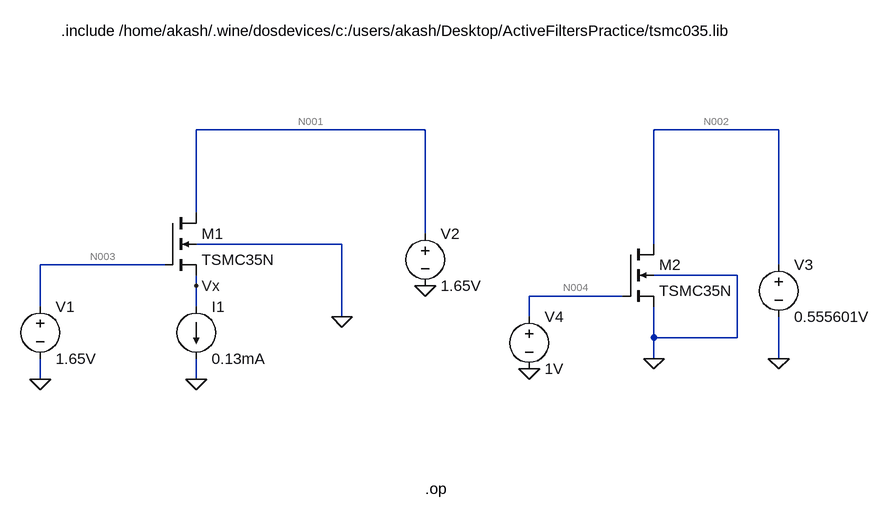
[diagram p0: schematic New_Transconductor_NMOS_Biasing.asc]
New_Transconductor_NMOS_Biasing.asc, the LTspice schematic file:
Version 4
SHEET 1 1112 744
WIRE 416 176 64 176
WIRE 960 176 768 176
WIRE 64 304 64 176
WIRE 416 336 416 176
WIRE 288 352 64 352
WIRE 768 352 768 176
WIRE 16 384 -176 384
WIRE 960 384 960 176
WIRE 896 400 768 400
WIRE 64 416 64 400
WIRE 720 432 576 432
WIRE -176 448 -176 384
WIRE 64 448 64 416
WIRE 288 464 288 352
WIRE 576 464 576 432
WIRE 768 496 768 448
WIRE 896 496 896 400
WIRE 896 496 768 496
WIRE 768 528 768 496
WIRE 960 528 960 464
WIRE -176 560 -176 528
WIRE 64 560 64 528
FLAG 288 464 0
FLAG -176 560 0
FLAG 416 416 0
FLAG 64 560 0
FLAG 960 528 0
FLAG 576 544 0
FLAG 768 528 0
FLAG 64 416 Vx
SYMBOL nmos4 16 304 R0
SYMATTR InstName M1
SYMATTR Value TSMC35N
SYMATTR Value2 l=0.5u w=1.77u m=8
SYMBOL voltage -176 432 R0
WINDOW 123 0 0 Left 0
WINDOW 39 0 0 Left 0
SYMATTR InstName V1
SYMATTR Value 1.65V
SYMBOL voltage 416 320 R0
WINDOW 123 0 0 Left 0
WINDOW 39 0 0 Left 0
SYMATTR InstName V2
SYMATTR Value 1.65V
SYMBOL current 64 448 R0
WINDOW 123 0 0 Left 0
WINDOW 39 0 0 Left 0
SYMATTR InstName I1
SYMATTR Value 0.13mA
SYMBOL voltage 960 368 R0
SYMATTR InstName V3
SYMATTR Value 0.555601V
SYMBOL nmos4 720 352 R0
SYMATTR InstName M2
SYMATTR Value TSMC35N
SYMATTR Value2 l=0.5u w=1.33u m=16
SYMBOL voltage 576 448 R0
WINDOW 123 0 0 Left 0
WINDOW 39 0 0 Left 0
SYMATTR InstName V4
SYMATTR Value 1V
TEXT -144 24 Left 2 !.include /home/akash/.wine/dosdevices/c:/users/akash/Desktop/ActiveFiltersPractice/tsmc035.lib
TEXT 416 728 Left 2 !.op

The netlist it stands for:
* New_Transconductor_NMOS_Biasing.asc
M1 N001 N003 Vx 0 TSMC35N l=0.5u w=1.77u m=8
V1 N003 0 1.65V
V2 N001 0 1.65V
I1 Vx 0 0.13mA
V3 N002 0 0.555601V
M2 N002 N004 0 0 TSMC35N l=0.5u w=1.33u m=16
V4 N004 0 1V
.model NMOS NMOS
.model PMOS PMOS
.lib standard.mos
.include /home/akash/.wine/dosdevices/c:/users/akash/Desktop/ActiveFiltersPractice/tsmc035.lib
.op
.backanno
.end

* Results of the author's LTspice run, read from the files saved beside the schematic
* Operating Point:
*   V(n001) = 1.65 V
*   V(n003) = 1.65 V
*   V(vx) = 555.6 mV
*   V(n002) = 555.6 mV
*   V(n004) = 1 V
*   Id(M2) = 260.3 µA
*   Ig(M2) = 0 A
*   Ib(M2) = -9.05 pA
*   Is(M2) = -260.3 µA
*   Id(M1) = 130 µA
*   Ig(M1) = 0 A
*   Ib(M1) = -17.8 pA
*   Is(M1) = -130 µA
*   I(I1) = 130 µA
*   I(V4) = 0 A
*   I(V3) = -260.3 µA
*   I(V2) = -130 µA
*   I(V1) = 0 A
* From the log:
*   Semiconductor Device Operating Points:
*                           --- BSIM3 MOSFETS ---
*   Name:        m2          m1
*   Model:     tsmc35n     tsmc35n
*   Id:        2.60e-04    1.30e-04
*   Vgs:       1.00e+00    1.09e+00
*   Vds:       5.56e-01    1.09e+00
*   Vbs:       0.00e+00   -5.56e-01
*   Vth:       6.65e-01    8.37e-01
*   Vdsat:     2.38e-01    2.07e-01
*   Gm:        1.55e-03    1.00e-03
*   Gds:       5.96e-05    1.60e-05
*   Gmb        3.79e-04    2.14e-04
*   Cbd:       0.00e+00    0.00e+00
*   Cbs:       0.00e+00    0.00e+00
*   Cgsov:     4.65e-15    3.31e-15
*   Cgdov:     4.65e-15    3.31e-15
*   Cgbov:     7.25e-16    3.63e-16
*   dQgdVgb:   3.73e-14    2.59e-14
*   dQgdVdb:  -4.53e-15   -3.19e-15
*   dQgdVsb:  -2.95e-14   -2.08e-14
*   dQddVgb:  -1.57e-14   -1.11e-14
*   dQddVdb:   4.59e-15    3.24e-15
*   dQddVsb:   1.43e-14    9.70e-15
*   dQbdVgb:  -5.90e-15   -3.71e-15
*   dQbdVdb:  -9.84e-18    1.21e-17
*   dQbdVsb:  -3.87e-15   -1.89e-15